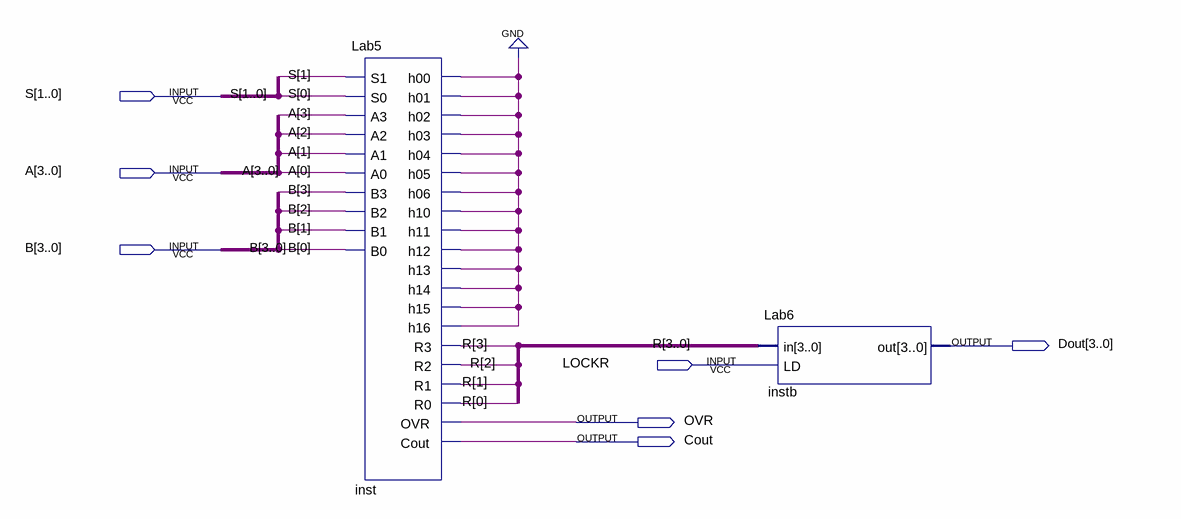
[diagram p0: schematic sheet]
// Quartus schematic ALU.bdf as structural Verilog: 2 symbols, 7 pins
module ALU (
  input  [1:0] S,
  input  [3:0] A,
  input  [3:0] B,
  input  LOCKR,
  output [3:0] Dout,
  output OVR,
  output Cout
);

  wire inst_h00;
  wire [3:0] R;

  Lab5 inst (
    .S1(S[1]), .S0(S[0]), .A3(A[3]), .A2(A[2]), .A1(A[1]), .A0(A[0]), .B3(B[3]), .B2(B[2]), .B1(B[1]),
    .B0(B[0]), .h00(inst_h00), .h01(inst_h00), .h02(inst_h00), .h03(inst_h00), .h04(inst_h00),
    .h05(inst_h00), .h06(inst_h00), .h10(inst_h00), .h11(inst_h00), .h12(inst_h00), .h13(inst_h00),
    .h14(inst_h00), .h15(inst_h00), .h16(inst_h00), .R3(R[3]), .R2(R[2]), .R1(R[1]), .R0(R[0]), .OVR(OVR),
    .Cout(Cout));
  Lab6 instb (.in(R), .LD(LOCKR), .out(Dout));
  // also tied to GND on the sheet: inst_h00
endmodule
